# EAGLE design uart2dali_mr3020_2 (EAGLE 6.3)
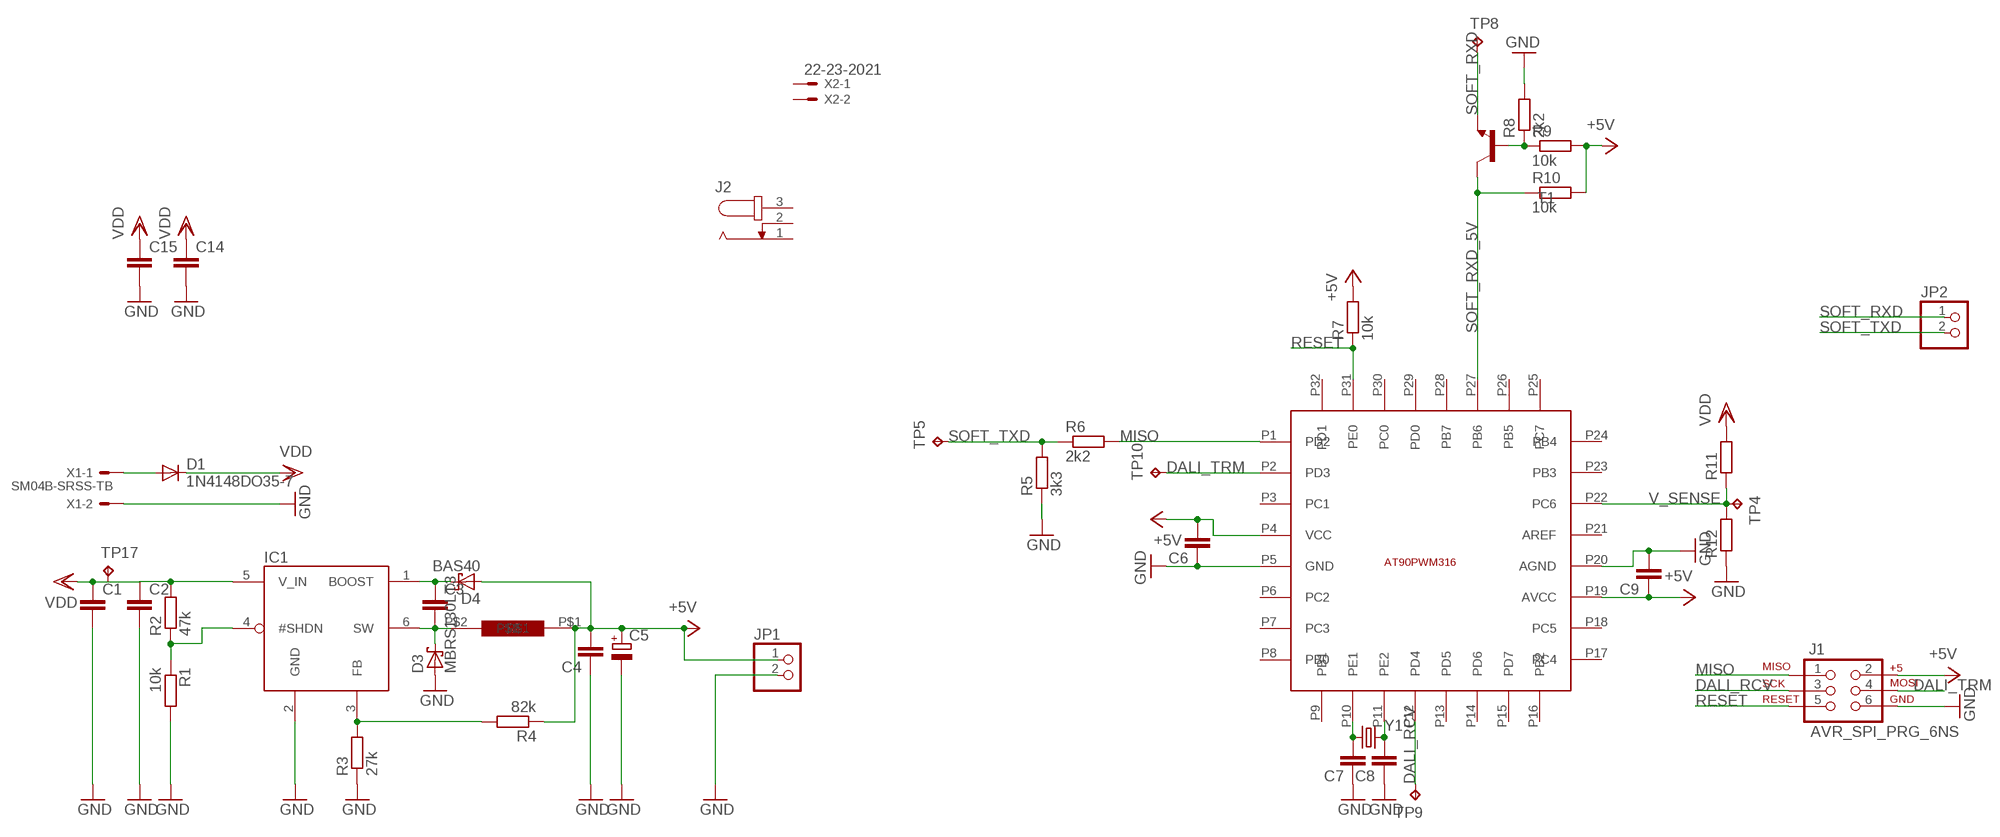
[diagram p0: schematic, sheet 1, part 1 of 2]
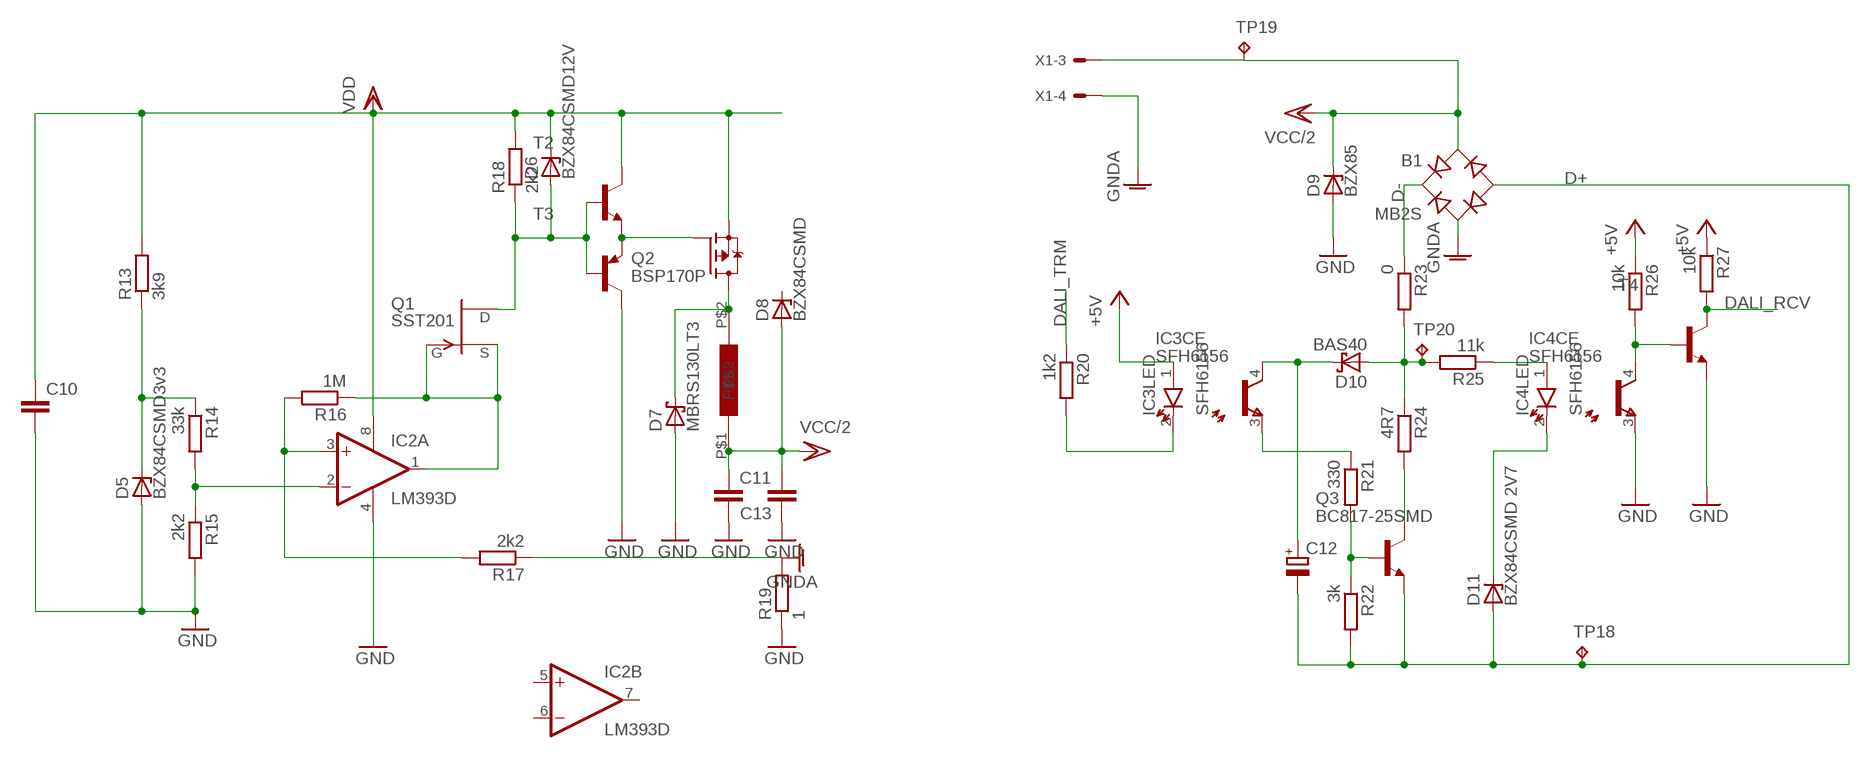
[diagram p1: schematic, sheet 1, part 2 of 2]

## Parts
B1  MB2S  [SOIC-4]
C1  C-EUC0805  [C0805]
C2  C-EUC0805  [C0805]
C3  C-EUC0805  [C0805]
C4  C-EUC0805  [C0805]
C5  CPOL-EUCT7343  [CT7343]
C6  C-EUC0603  [C0603]
C7  C-EUC0603  [C0603]
C8  C-EUC0603  [C0603]
C9  C-EUC0603  [C0603]
C10  C-EUC0603  [C0603]
C11  C-EUC0805  [C0805]
C12  CPOL-EUCT6032  [CT6032]
C13  C-EUC0805  [C0805]
C14  C-EUC0805  [C0805]
C15  C-EUC0805  [C0805]
D1  1N4148DO35-7  [DO35-7]
D3  MBRS130LT3  [SMB]
D4  BAS40  [SOT23]
D5  BZX84CSMD3v3  BZX84CSMD  [TO236]
D6  BZX84CSMD12V  BZX84CSMD  [TO236]
D7  MBRS130LT3  [SMB]
D8  BZX84CSMD  [TO236]
D9  BZX85  [DO41Z10]
D10  BAS40  [SOT23]
D11  BZX84CSMD 2V7  BZX84CSMD  [TO236]
IC1  LT1933ES6  [SOT23-6]
IC2  LM393D  [SO08]
IC3  SFH6156  [SFH]
IC4  SFH6156  [SFH]
J1  AVR_SPI_PRG_6NS  [2X3-NS]
J2  JACK-PLUG1  [SPC4078]
JP1  PINHD-1X2  [1X02]
JP2  PINHD-1X2  [1X02]
Q1  SST201  [SOT23]
Q2  BSP170P  [SOT223]
Q3  BC817-25SMD  [SOT23-BEC]
R1  10k  R-EU_R0603  [R0603]
R2  47k  R-EU_R0603  [R0603]
R3  27k  R-EU_R0603  [R0603]
R4  82k  R-EU_R0603  [R0603]
R5  3k3  R-EU_R0603  [R0603]
R6  2k2  R-EU_R0603  [R0603]
R7  10k  R-EU_R0603  [R0603]
R8  2k2  R-EU_R0603  [R0603]
R9  10k  R-EU_R0603  [R0603]
R10  10k  R-EU_R0603  [R0603]
R11  R-EU_R0603  [R0603]
R12  R-EU_R0603  [R0603]
R13  3k9  R-EU_R0603  [R0603]
R14  33k  R-EU_R0603  [R0603]
R15  2k2  R-EU_R0603  [R0603]
R16  1M  R-EU_R0603  [R0603]
R17  2k2  R-EU_R0603  [R0603]
R18  2k2  R-EU_R0603  [R0603]
R19  1  R-EU_R0603  [R0603]
R20  1k2  R-EU_R0603  [R0603]
R21  330  R-EU_R0603  [R0603]
R22  3k  R-EU_R0603  [R0603]
R23  0  R-EU_R0603  [R0603]
R24  4R7  R-EU_R0603  [R0603]
R25  11k  R-EU_R0603  [R0603]
R26  10k  R-EU_R0603  [R0603]
R27  10k  R-EU_R0603  [R0603]
T1  MMBT3904LT1-NPN-SOT23-BEC  [SOT23-BEC]
T2  MMBT3904LT1-NPN-SOT23-BEC  [SOT23-BEC]
T3  MMBT3640LT1-PNP-SOT23-BEC  [SOT23-BEC]
T4  MMBT3904LT1-NPN-SOT23-BEC  [SOT23-BEC]
TP4  TPB1,27  [B1,27]
TP5  TPB1,27  [B1,27]
TP8  TPB1,27  [B1,27]
TP9  TPB1,27  [B1,27]
TP10  TPB1,27  [B1,27]
TP17  TPB1,27  [B1,27]
TP18  TPB1,27  [B1,27]
TP19  TPB1,27  [B1,27]
TP20  TPB1,27  [B1,27]
U$1  KMP_2330_UNSHIELDED  [KMP_2330_UNSHIELDED]
U$2  AT90PWM316  [QFN32_7MM]
U$3  SDR0805  [SDR0805]
X1  SM04B-SRSS-TB  [SM04B-SRSS-TB]
X2  22-23-2021  [22-23-2021]
Y1  CRYSTALTXC-7A  [CRYSTAL-TXC-7A]

## Nets
+5V: C4.2 C5.+ C6.2 C9.1 D4.1(A) IC3.1(LED:A) J1.2 JP1.1 R4.1 R7.2 R9.2 R10.2 R26.1 R27.1 U$1.P$1 U$2.P4(VCC) U$2.P19(AVCC)
D+: B1.- C12.- D11.A Q3.E R22.2 TP18.TP
D-: B1.+ R23.1
DALI_RCV: IC4.4(CE:C) J1.3 R26.2 R27.2 T4.B T4.C TP9.TP U$2.P12(PD4)
DALI_TRM: J1.4 R20.1 TP10.TP U$2.P2(PD3)
GND: C1.2 C2.2 C4.1 C5.- C6.1 C7.1 C8.1 C9.2 C10.2 C11.2 C13.1 C14.2 C15.2 D3.A D5.A D7.A D9.A IC1.2(GND) IC2.4(P:V-) IC4.3(CE:E) J1.6 JP1.2 R1.2 R3.1 R5.1 R8.2 R12.1 R15.2 R19.1 T3.C T4.E U$2.P5(GND) U$2.P20(AGND) X1.2
GNDA: B1.~2(AC2) R17.1 R19.2 X1.4
MISO: J1.1 R6.2 U$2.P1(PD2)
N$1: IC3.2(LED:K) R20.2
N$2: IC2.2(A:-IN) R14.2 R15.1
N$3: IC1.4(#SHDN) R1.1 R2.1
N$4: C12.+ D10.3(C) IC3.4(CE:C)
N$5: IC3.3(CE:E) R21.1
N$6: Q3.B R21.2 R22.1
N$9: D10.1(A) R23.2 R24.1 R25.2 TP20.TP
N$10: Q3.C R24.2
N$11: IC4.1(LED:A) R25.1
N$12: D11.C IC4.2(LED:K)
N$16: C7.2 U$2.P10(PE1) Y1.P$1
N$19: C8.2 U$2.P11(PE2) Y1.P$2
N$20: R8.1 R9.1 T1.B
N$22: IC2.1(A:OUT) Q1.2(S) Q1.3(G) R16.1
N$23: D1.A X1.1
N$24: C3.1 D4.3(C) IC1.1(BOOST)
N$25: C3.2 D3.C IC1.6(SW) U$1.P$2
N$26: D7.C Q2.2(D) Q2.4(D) U$3.P$2
N$31: IC1.3(FB) R3.2 R4.2
N$33: Q2.1(G) T2.E T3.E
N$34: D6.A Q1.1(D) R18.1 T2.B T3.B
N$35: D5.C R13.1 R14.1
N$40: IC2.3(A:+IN) R16.2 R17.2
RESET: J1.5 R7.1 U$2.P31(PE0)
SOFT_RXD: JP2.1 T1.E TP8.TP
SOFT_RXD_5V: R10.1 T1.C U$2.P27(PB6)
SOFT_TXD: JP2.2 R5.2 R6.1 TP5.TP
V_SENSE: R11.1 R12.2 TP4.TP U$2.P22(PC6)
VCC/2: B1.~1(AC1) C11.1 C13.2 D8.A D9.C TP19.TP U$3.P$1 X1.3
VDD: C1.1 C2.1 C10.1 C14.1 C15.1 D1.C D6.C IC1.5(V_IN) IC2.8(P:V+) Q2.3(S) R2.2 R11.2 R13.2 R18.2 T2.C TP17.TP
Unconnected: D8.C IC2.5(B:+IN) IC2.6(B:-IN) IC2.7(B:OUT) J2.1 J2.2 J2.3 U$2.P3(PC1) U$2.P6(PC2) U$2.P7(PC3) U$2.P8(PB0) U$2.P9(PB1) U$2.P13(PD5) U$2.P14(PD6) U$2.P15(PD7) U$2.P16(PB2) U$2.P17(PC4) U$2.P18(PC5) U$2.P21(AREF) U$2.P23(PB3) U$2.P24(PB4) U$2.P25(PC7) U$2.P26(PB5) U$2.P28(PB7) U$2.P29(PD0) U$2.P30(PC0) U$2.P32(PD1) X2.1 X2.2

## Library data of the parts
B1 = rectifier:MB*S: Bridge Rectifier Source: http://www.fairchildsemi.com/ds/MB/MB6S.pdf
C1-C4 C6-C11 C13-C15 = resistor:C-EU: CAPACITOR, European symbol
C5 C12 = resistor:CPOL-EU: POLARIZED CAPACITOR, European symbol
D1 = diode:1N4148: DIODE high speed (Philips)
D3 D7 = diode:MBRS130LT3: Schottky Power Rectifier Source: http://www.onsemi.com/pub/Collateral/MBRS130LT3-D.PDF
D4 D10 = diode:BAS40: Silicon Schottky Diodes General-purpose diode for high-speed switching
D5 D6 D8 D11 = diode:BZX84CSMD: Z DIODE
D9 = diode:BZX85: Z DIODE
IC1 = ltc_swr:LT1933: LT1933 - 600mA, 500kHz Step-Down Switching Regulator in SOT-23 Wide Input Range: 3.6V to 36V 5V at 600mA from 16V to 36V Input 3.3V at 600mA from 12V to 36V Input 5V at 500mA from 6.3V to 36V Input 3.3V at 500mA from 4.5V to 36V Input Fixed Frequency 500kHz Operation Uses Tiny Capacitors and Inductors Soft-Start Internally Compensated Low Shutdown Current: <2µA Output Adjustable Down to 1.25V Low Profile (1mm) SOT-23 (ThinSOT™) and (2mm x 3mm x 0.75mm) 6-Pin DFN Packages
IC2 = linear:LM393: COMPARATOR
IC3 IC4 = optocoupler:SFH6156: 5.3 kV TRIOS High Reliability Optocoupler; MF: VISHAY/TELEFUNKEN; MPN: SFH6156-4T; OC_FARNELL: 1612479; OC_NEWARK: 21H7733
J1 = SparkFun-Connectors:AVR_SPI_PRG_6: AVR ISP 6 Pin This is the reduced ISP connector for AVR programming. Common on Arduino. This footprint will take up less PCB space and can be used with a 10-pin to 6-pin adapter such as SKU: BOB-08508
J2 = con-jack:JACK-PLUG: DC POWER JACK Power Jack, DC, Right Angle, Through Hole, Rated 5A at 16VDC, PC Terminals Distributor: Farnell (www.Farnell.de) Drawing: 84N1161.pdf / 84N1162.pdf Manufacturer: SPC Technology (www.spctechnology.com) Type: SPC4077 / SPC 4078; OC_FARNELL: unknown; OC_NEWARK: unknown
JP1 JP2 = pinhead:PINHD-1X2: PIN HEADER
Q1 = transistor-fet:?20*: TEMIC / Siliconix N-Channel JFET Source: JFET-J201_Siliconix_data.pdf
Q2 = transistor-fet:BSP170P: SIPMOS(R) Small-Signal-Transistor P-Channel, Enhancement mode Source: http://www.infineon.com/upload/Document/BSP170P_Rev2.4.pdf
Q3 = transistor-npn:BC817*: NPN Transistor
R1-R27 = resistor:R-EU_: RESISTOR, European symbol
T1 T2 T4 = transistor:*-NPN-: NPN Transistror BF959 corrected 2008.03.06
T3 = transistor:*-PNP-: PNP Transistror
TP4 TP5 TP8-TP10 TP17-TP20 = testpad:TP: Test pad
U$1 = inductor:KMP_2330_UNSHIELDED
U$2 = at90pwm316:AT90PWM316
U$3 = inductor:SDR0805
X1 = con-jst2:?M04B-SRSS-TB: Disconnectable Crimp style connector, 1.0mm pitch 4 contacts
X2 = con-molex:22-23-2021: .100" (2.54mm) Center Header - 2 Pin; MF: MOLEX; MPN: 22-23-2021; OC_FARNELL: 1462926; OC_NEWARK: 25C3832
Y1 = SparkFun-FreqCtrl:CRYSTAL: Various standard crystals. Proven footprints. Spark Fun Electronics SKU : COM-00534

## Board
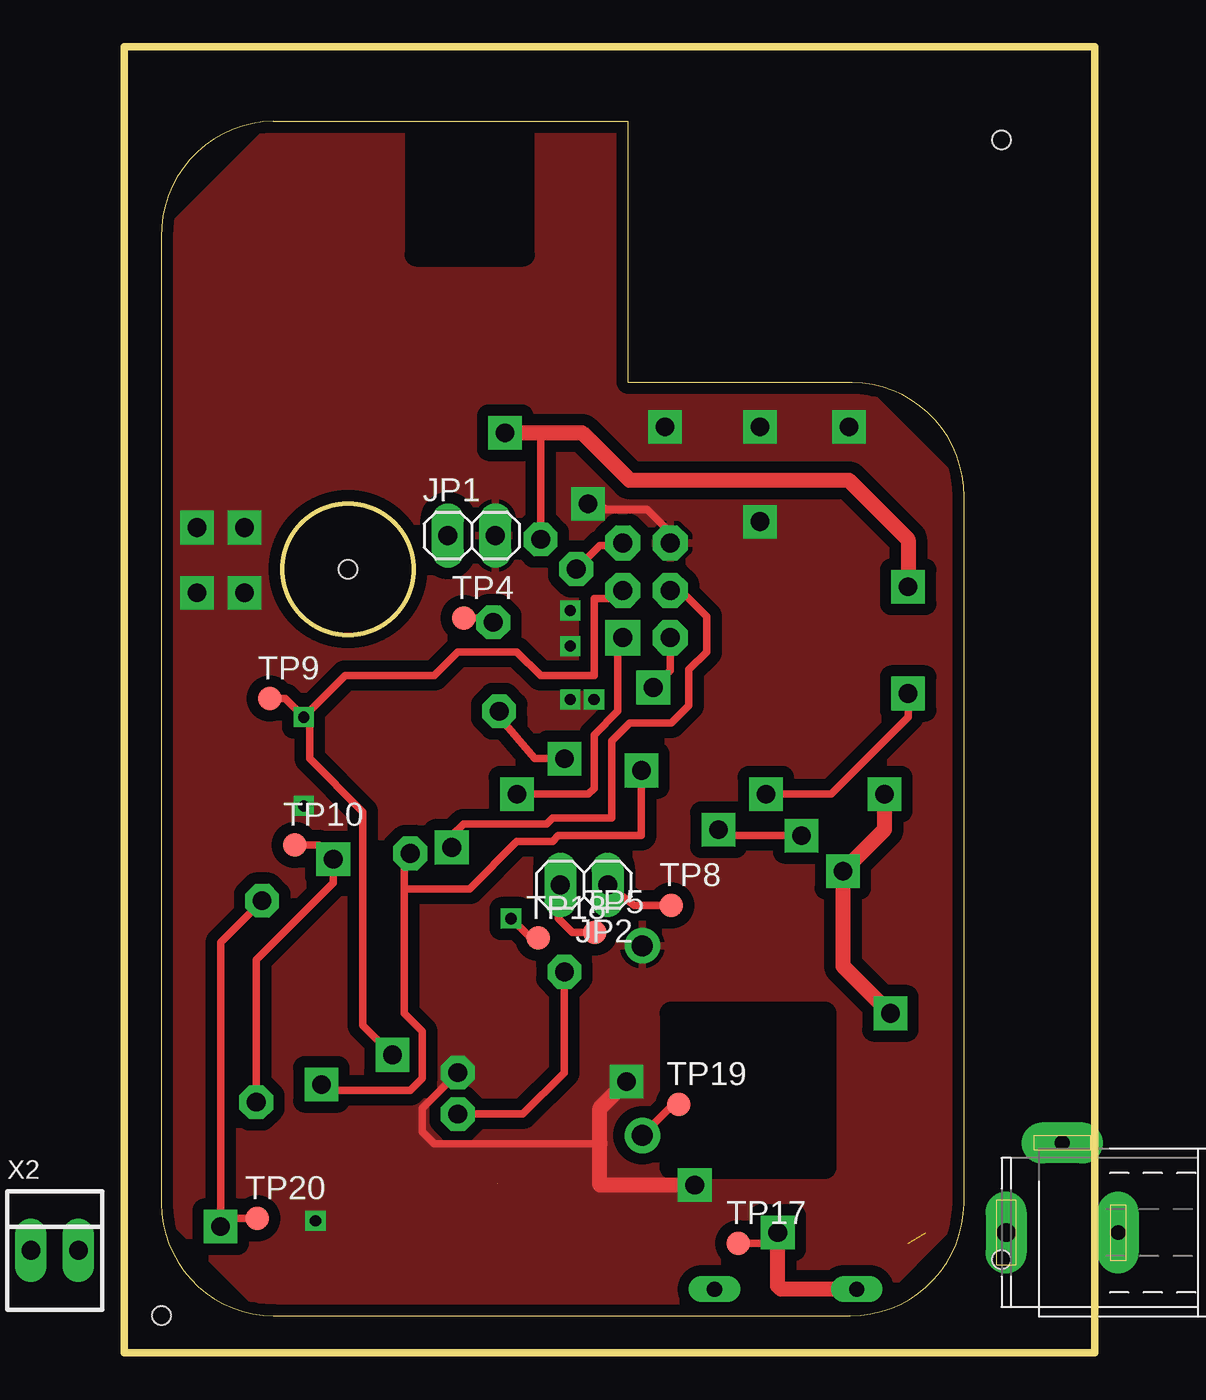
[diagram p2: board, top side]
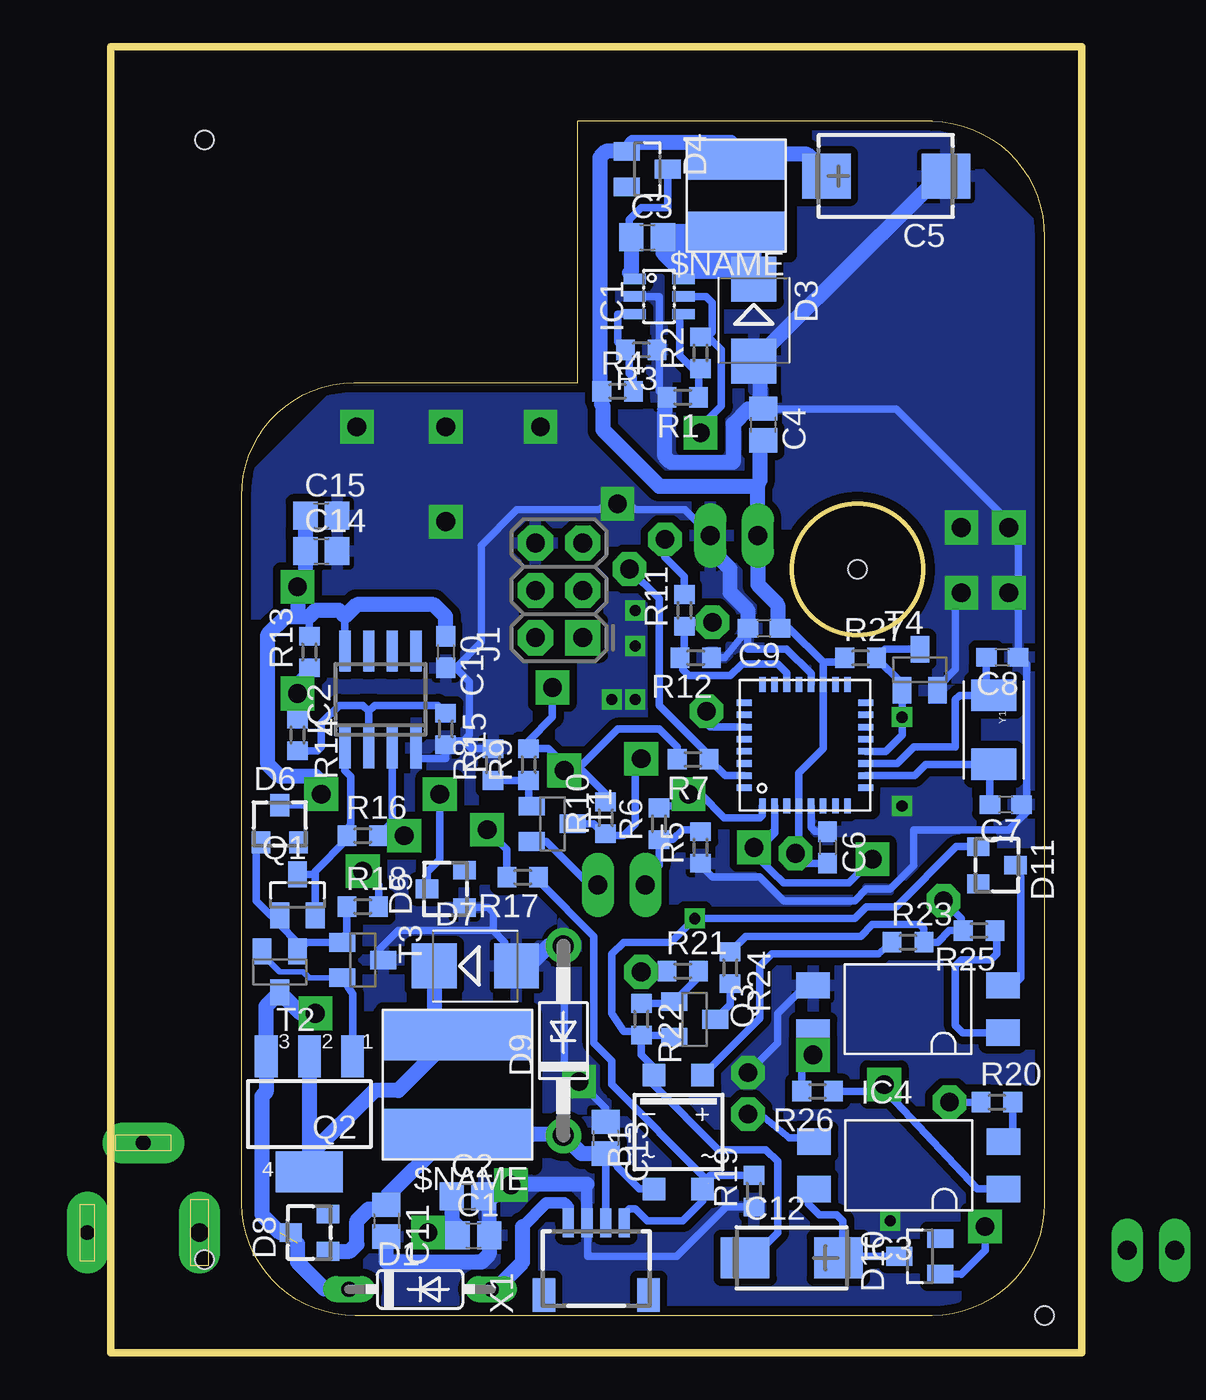
[diagram p3: board, bottom side, seen from below]

Size 52 x 70 mm. Coordinates in mm from the lower left corner, seen from the top.
Outline: 8,66 arc90 2,59.8 2,8 arc90 8,2 38.9,2 arc90 45,8 45,45.9 arc90 39,52 27,52 27,66 8,66
Outline: 0,0 52,0 52,70 0,70 0,0
Outline: circle at 12,42 radius 3.5
Copper layers (1*16): Top 0.035mm / dielectric 1.5mm / Bottom 0.035mm
Design rules "default *": minimum track width 10mil, minimum drill 24mil, track to track 12mil, track to pad 12mil, pad to pad 10mil, via to via 8mil, smd to smd 0mil, copper to edge 20mil, drill to drill 8mil, minimum pad ring 10mil, minimum via ring 8mil, stop-mask expansion 4mil, vias tented up to drill 0mil, thermal gap 10mil
Holes 1 mm at 47,65 47,5 12,42 2,2
bKeepout: area 2,46 to 15,60
tRestrict: area 29.3,9.9 to 37.6,18.2; area 15.7,58.8 to 21.4,65.8
bRestrict: area 11.2,29 to 18.5,36.3; area 29.3,9.9 to 37.6,18.2; area 15.7,58.8 to 21.4,65.8; area 5.8,33.1 to 8,34.4

### Footprints (pad centres in the part's own frame; a part is rotated, then mirrored left to right if it is on the bottom)
SOIC-4 = smd 1.2 x 1.2: + 1.3,3.05; - -1.3,3.05; ~1 -1.3,-3.05; ~2 1.3,-3.05
C0805 = smd 1.3 x 1.5: 1 -0.85,0; 2 0.85,0
CT7343 = smd 2.6 x 2.4: + 3.2,0; - -3.2,0
C0603 = smd 1.1 x 1: 1 -0.85,0; 2 0.85,0
CT6032 = smd 2.6 x 2.2: + 2.5,0; - -2.5,0
DO35-7 = drill 0.813 long: A 3.81,0; C -3.81,0
SMB = smd 2.4 x 2.4: A 2.2,0; C -2.2,0
SOT23 = smd 1 x 1.4: 1 -0.95,-1.1; 2 0.95,-1.1; 3 0,1.1
TO236 = smd 1 x 1.2: A -1,-1; C 0,1; NC 1,-1
DO41Z10 = drill 1.118: A 5.08,0; C -5.08,0
SOT23-6 = smd 0.55 x 1.2: 1 -0.95,-1.3; 2 0,-1.3; 3 0.95,-1.3; 4 0.95,1.3; 5 0,1.3; 6 -0.95,1.3
SO08 = smd 0.6 x 2.2: 1 -1.905,-2.6; 2 -0.635,-2.6; 3 0.635,-2.6; 4 1.905,-2.6; 5 1.905,2.6; 6 0.635,2.6; 7 -0.635,2.6; 8 -1.905,2.6
SFH = smd 1.4 x 1.8: 1 1.27,5.08; 2 -1.27,5.08; 3 -1.27,-5.08; 4 1.27,-5.08
2X3-NS = drill 1.016 pad 1.88 square: 1 -2.54,-1.27 | drill 1.016 pad 1.88 octagon: 2 -2.54,1.27; 3 0,-1.27; 4 0,1.27; 5 2.54,-1.27; 6 2.54,1.27
SPC4078 = drill 0.8 pad 2.184 long: 1 -3,0; 2 0,-4.8 | drill 1 pad 2.184 long: 3 3,0
1X02 = drill 1.016 long: 1 -1.27,0; 2 1.27,0
SOT223 = smd 1.219 x 2.235: 1 -2.311,-3.099; 2 0,-3.099; 3 2.311,-3.099 | smd 3.6 x 2.2: 4 0,3.099
SOT23-BEC = smd 1 x 1.4: B -0.95,-1.1; C 0,1.1; E 0.95,-1.1
R0603 = smd 1 x 1.1: 1 -0.85,0; 2 0.85,0
B1,27 = smd 1.27 x 1.27: TP 0,0
KMP_2330_UNSHIELDED = smd 5.3 x 2.15: P$1 0,-1.925; P$2 0,1.925
QFN32_7MM = smd 0.813 x 0.35: P1 -3.25,2.275; P2 -3.25,1.625; P3 -3.25,0.975; P4 -3.25,0.325; P5 -3.25,-0.325; P6 -3.25,-0.975; P7 -3.25,-1.625; P8 -3.25,-2.275; P17 3.25,-2.275; P18 3.25,-1.625; P19 3.25,-0.975; P20 3.25,-0.325; P21 3.25,0.325; P22 3.25,0.975; P23 3.25,1.625; P24 3.25,2.275 | smd 0.35 x 0.813: P9 -2.275,-3.25; P10 -1.625,-3.25; P11 -0.975,-3.25; P12 -0.325,-3.25; P13 0.325,-3.25; P14 0.975,-3.25; P15 1.625,-3.25; P16 2.275,-3.25; P25 2.275,3.25; P26 1.625,3.25; P27 0.975,3.25; P28 0.325,3.25; P29 -0.325,3.25; P30 -0.975,3.25; P31 -1.625,3.25; P32 -2.275,3.25
SDR0805 = smd 8 x 2.7: P$1 0,2.65; P$2 0,-2.65
SM04B-SRSS-TB = smd 0.6 x 1.55: 1 -1.5,2.975; 2 -0.5,2.975; 3 0.5,2.975; 4 1.5,2.975 | smd 1.2 x 1.8: FIT@1 -2.8,-0.9; FIT@2 2.8,-0.9
22-23-2021 = drill 1 long: 1 -1.27,0; 2 1.27,0
CRYSTAL-TXC-7A = smd 1.7 x 2.4: P$1 1.85,0; P$2 -1.85,0

### Placement (x,y rotation side)
B1  21.6,11.83 0 bottom
C1  32.59,6.29 0 bottom
C2  32.89,8.38 0 bottom
C3  23.27,59.78 0 bottom
C4  17.06,49.75 270 bottom
C5  10.48,63.06 180 bottom
C6  13.61,27.09 270 bottom
C7  4.07,29.38 180 bottom
C8  4.25,37.28 180 bottom
C9  17.02,38.83 180 bottom
C10  34.07,37.56 270 bottom
C11  37.24,7.08 270 bottom
C12  15.53,5.09 0 bottom
C13  25.5,11.53 270 bottom
C14  40.73,42.96 0 bottom
C15  40.73,44.86 0 bottom
D1  35.44,3.41 0 bottom
D3  17.56,55.34 270 bottom
D4  23.27,63.44 270 bottom
D5  34.07,24.86 90 bottom
D6  42.96,28.35 0 bottom
D7  32.48,20.73 0 bottom
D8  41.37,6.45 90 bottom
D9  27.77,16.73 90 bottom
D10  8.67,5.17 90 bottom
D11  4.54,26.13 270 bottom
IC1  22.64,56.61 270 bottom
IC2  37.56,35.02 0 bottom
IC3  9.25,10.05 270 bottom
IC4  9.3,18.43 270 bottom
J1  27.99,40.86 90 bottom
J2  50.26,6.45 180 top
JP1  18.62,43.8 0 top
JP2  24.64,25.08 180 top
Q1  42.01,24.54 0 bottom
Q2  41.37,12.79 180 bottom
Q3  20.73,17.88 270 bottom
R1  21.37,51.21 180 bottom
R2  20.41,53.59 90 bottom
R3  23.59,53.75 180 bottom
R4  24.86,51.53 0 bottom
R5  20.41,27.08 90 bottom
R6  22.64,28.35 90 bottom
R7  20.81,31.8 180 bottom
R8  31.53,31.53 90 bottom
R9  29.62,31.53 90 bottom
R10  25.5,28.67 90 bottom
R11  21.28,39.78 90 bottom
R12  20.67,37.25 180 bottom
R13  41.37,37.56 90 bottom
R14  42.01,33.11 270 bottom
R15  34.07,33.43 270 bottom
R16  38.51,27.72 0 bottom
R17  29.94,25.5 180 bottom
R18  38.51,23.91 0 bottom
R19  17.56,8.67 90 bottom
R20  4.54,13.43 0 bottom
R21  21.37,20.46 0 bottom
R22  23.59,17.88 270 bottom
R23  9.3,22 0 bottom
R24  18.83,20.64 270 bottom
R25  5.49,22.64 180 bottom
R26  14.14,14.02 180 bottom
R27  11.84,37.24 0 bottom
T1  28.35,28.35 270 bottom
T2  42.96,20.41 180 bottom
T3  38.51,21.05 270 bottom
T4  8.67,36.61 0 bottom
TP4  18.2,39.37 0 top
TP5  25.21,22.54 0 top
TP8  29.32,23.98 0 top
TP9  7.81,35.06 0 top
TP10  9.16,27.22 0 top
TP17  32.91,5.88 0 top
TP18  22.18,22.23 0 top
TP19  29.7,13.32 0 top
TP20  7.13,7.21 0 top
U$1  18.51,62.01 180 bottom
U$2  14.82,32.56 90 bottom
U$3  33.43,14.38 180 bottom
X1  26,4 0 bottom
X2  -3.71,5.49 0 top
Y1  4.71,33.39 270 bottom

### Tracks (layer width: path | path; a pad name or v marks a point on that pad's centre or on a via)
+5V  (via drill 1)
  Top 0.406: v27.72,31.21 27.72,27.72 23.27,27.72 22.95,27.4 21.05,27.4 18.51,24.86 15.02,24.86 | 15.02,24.86 15.02,18.19 15.97,17.24 15.97,14.7 15.34,14.06 10.57,14.06 v10.57,14.38 | v15.34,26.77 15.02,26.45 15.02,24.86 | J1.2 29.26,36.56 v28.35,35.66
  Bottom 0.406: IC3.1 5.61,8.78 9.94,13.43 10.26,13.75 v10.57,14.38 10.62,14.02 R26.1 | 27.72,31.53 28.57,32.38 R9.2 29.62,32.8 28.35,34.07 v28.35,35.66 | 27.72,31.53 v27.72,31.21 26.77,31.21 25.5,29.94 R10.2 | C9.1 15.65,38.83 13.85,37.02 | 13.85,37.02 U$2.P19 13.85,32.38 15.15,31.08 U$2.P4 15.15,26.89 v15.34,26.77 14.8,26.23 C6.2 | R7.2 21.66,32.46 22.64,33.43 24.86,33.43 26.77,31.53 27.72,31.53 | 13.85,37.02 12.91,37.02 R27.1
  Bottom 0.813: 17.87,63.99 18.8,64.85 24.06,64.85 D4.1 25.49,64.39 25.81,64.07 25.81,51.63 R4.1 25.71,50.84 25.65,50.74 25.65,49.47 22.64,46.45 17.38,46.45 | 17.87,63.99 U$1.P$1 | C5.+ 14.13,63.66 14.7,64.23 17.63,64.23 17.87,63.99 | C4.2 17.24,48.9 17.24,46.77 17.38,46.45 | 17.38,46.45 17.38,45.1 JP1.1 17.35,41.16 16.29,40.1 16.29,38.95 C9.1
D+  (via drill 0.6)
  Top 0.406: TP18.TP 22.1,21.91 v20.73,23.27
  Bottom 0.406: C12.- 17.64,5.09 16.29,6.45 16.29,10.26 16.92,10.89 19.46,10.89 22.95,14.38 22.95,14.82 B1.- 22.9,15.28 23.59,15.97 R22.2 | R22.2 21.93,17.02 Q3.E | D11.A 6.71,27.13 9.94,23.91 11.53,23.91 12.16,23.27 v20.73,23.27 22,22 24.54,22 25.18,21.37 25.18,18.19 24.54,17.24 23.8,17.24 R22.2
D-
  Bottom 0.406: R23.1 10.89,21.37 16.61,21.37 17.24,20.73 17.24,17.94 B1.+
DALI_RCV  (via drill 0.6, 1)
  Top 0.406: v14.38,15.97 12.79,17.56 12.79,28.99 9.94,31.84 9.94,33.75 v9.62,34.07 | J1.3 26.27,40.42 25.18,40.42 25.18,36.29 22.32,36.29 21.05,37.56 17.88,37.56 16.61,36.29 11.84,36.29 v9.62,34.07 | 7.81,35.11 TP9.TP 8.62,35.06 v9.62,34.07
  Bottom 0.406: R26.2 15.02,14.06 14.99,14.36 14.99,15.97 | 14.99,15.97 14.99,16.86 IC4.4 | v14.38,15.97 14.99,15.97 | U$2.P12 10.5,32.23 9.62,33.11 v9.62,34.07 T4.B 9.62,35.87 R27.2 10.53,37.71 T4.C
DALI_TRM  (via drill 1)
  Top 0.406: v7.08,13.43 7.08,21.05 11.21,25.18 v11.21,26.45 10.44,27.22 TP10.TP | J1.4 29.81,40.86 31.21,39.47 31.21,37.56 30.26,36.61 30.26,34.7 29.3,33.75 27.08,33.75 26.13,32.8 26.13,28.67 22.95,28.67 22.64,28.35 18.19,28.35 17.56,27.72 v17.56,27.08
  Bottom 0.406: U$2.P2 16.45,28.04 | 16.45,28.04 16.45,27.88 17.24,27.08 17.24,26.45 16.77,25.97 16.61,25.81 15.97,25.18 12.48,25.18 v11.21,26.45 | v7.08,13.43 R20.1 | v17.56,27.08 16.45,28.04
GND  (via drill 0.6, 1)
  Top 0.406: v17.88,15.02 15.97,13.11 15.97,11.84 16.61,11.21 25.5,11.21 | J1.6 29.26,43.96 28.04,45.18 25.81,45.18 25.5,45.5 v24.86,45.5
  Top 0.813: v30.57,8.98 25.5,8.98 25.5,11.21 25.5,13.11 v26.92,14.54
  Bottom 0.406: T3.C 37.73,21.52 36.61,22.64 31.53,22.64 | 31.53,22.64 30.89,22 30.89,20.71 D7.A | D5.A 31.8,23.86 31.53,23.59 31.53,22.64 | C10.2 33.53,36.71 | 33.53,36.71 32.8,35.97 32.8,33.11 33.11,32.8 | 33.11,32.8 33.85,32.8 R15.2 34.07,31.84 35.66,31.84 IC2.4 | C13.1 25.5,13.11 v26.92,14.54 27.72,15.34 27.72,21.45 D9.A | IC4.3 15.1,19.38 16.29,18.19 16.29,16.61 v17.88,15.02 | X1.2 26.45,6.92 26.45,5.17 21.68,5.17 19.04,7.82 R19.1 | IC1.2 22.64,56.61 22.64,53.85 R3.1 22.64,53.65 22.64,51.53 22.22,51.11 R1.2 | U$2.P20 14.5,36.41 15.81,37.72 17.88,37.72 17.88,38.2 C9.2 19.13,37.25 R12.1 | C4.1 17.36,50.58 17.24,50.58 9.94,50.58 3.41,44.05 C8.1 3.3,37.28 2.95,36.92 2.95,29.65 C7.1 2.95,29.12 2.95,28.99 3.91,28.04 8.98,28.04 8.98,26.13 10.26,24.86 11.53,24.86 12.16,24.23 15.97,24.23 17.24,25.5 19.78,25.5 20.41,26.13 R5.1 | JP1.2 21.27,45.18 23.91,45.18 24.23,45.5 v24.86,45.5 25.5,45.5 25.81,45.18 30.26,45.18 32.16,43.27 32.16,38.08 33.53,36.71 | U$2.P5 14.5,28.15 14.28,27.93 C6.1 | R8.2 32.7,32.38 33.11,32.8 | T4.E 7.72,35.65 6.76,36.61 6.76,40.42 v6.45,40.73
  Bottom 0.61: X1.2 26.5,9.04
  Bottom 0.813: 26.5,9.04 30.52,9.04 v30.57,8.98 31.53,8.35 31.69,8.35 C2.2 31.74,8.37 C1.2 31.74,5.28 32.16,4.86 37.24,4.86 C11.2 | D9.A 28.57,21.81 28.57,21.79 29.62,20.73 D7.A | D3.A 15.02,55.68 13.43,57.24 8.03,62.64 7.7,62.64 C5.- | D3.A 17.24,52.8 17.24,50.77 C4.1 | D3.A 17.24,52.48 17.24,50.58 17.88,50.58 18.67,49.78 18.67,47.72 22,47.72 22.32,48.04 22.32,50.48 R1.2 | C9.2 17.87,39.77 18.83,40.73 18.83,42.01 19.78,42.96 19.78,43.69 JP1.2
  other vias: 28.99,49.62 34.07,49.62 38.83,49.62 3.91,40.73 3.91,44.23 34.07,44.55 6.45,44.23 23.91,37.88 23.91,39.78 23.91,35.02 25.18,35.02 9.62,29.3 10.26,7.08
  pour Top (isolate 0.61): 2,59.78 8.03,65.82 27.08,65.82 27.08,52.16 39.47,52.16 39.47,51.85 45.18,46.13 45.18,7.71 39.47,2 7.71,2 2,7.71
  pour Bottom (isolate 0.406): 2,59.78 8.03,65.82 27.08,65.82 27.08,52.16 39.15,52.16 39.47,51.85 44.86,46.45 45.18,46.13 45.18,7.71 39.47,2 7.71,2 2,7.71
GNDA  (1 unrouted)
  Bottom 0.406: X1.4 24.54,7.02 24.54,7.4 24.23,7.71 23.91,7.71 23.27,7.08 21.37,7.08 20.3,8.15 B1.~2 19.99,9.09 | 20,9.09 20.1,8.98 20.1,9.3 | 20.1,9.3 25.18,14.38 25.18,15.65 26.13,16.61 26.13,22.32 28.99,25.18 28.99,25.39 R17.1 | R19.2 19.88,9.52 20.1,9.3
MISO  (via drill 1)
  Top 0.406: v21.05,29.94 24.86,29.94 25.18,30.26 25.18,33.11 26.45,34.38 26.45,38.05 J1.1
  Bottom 0.406: U$2.P1 17.1,28.81 17.24,28.67 19.15,28.68 20.41,29.94 v21.05,29.94 21.68,29.3 22.32,29.3 | 22.32,29.3 22.54,29.3 | 22.54,29.3 R6.2 | 22.54,29.3 22.54,29.41 22.32,29.3
N$1
  Bottom 0.406: R20.2 3.69,11.8 IC3.2
N$2
  Bottom 0.406: IC2.2 38.2,34.38 | 38.2,34.38 37.88,34.7 34.49,34.7 R15.1 | R14.2 40.95,32.27 40.73,32.48 40.73,33.75 39.78,34.7 38.51,34.7 38.2,34.38
N$3
  Bottom 0.406: R1.1 20.52,52.69 R2.1 20.84,52.74 21.53,53.44 21.53,55.63 IC1.4
N$4
  Bottom 0.406: IC3.4 14.65,7.99 14.06,7.4 13.11,7.4 12.79,7.08 12.79,5.33 C12.+ 12.95,5.17 D10.3
N$5  (via drill 1)
  Top 0.406: v23.59,20.41 23.59,15.02 21.37,12.79 v17.88,12.79
  Bottom 0.406: R21.1 22.27,20.46 v23.59,20.41 | v17.88,12.79 17.24,12.79 15.65,11.53 14.86,11.53 IC3.3
N$6
  Bottom 0.406: R21.2 20.52,20.14 Q3.B 21.93,18.73 R22.1
N$9  (via drill 1)
  Top 0.406: v7.4,24.23 5.17,22 v5.17,6.76 5.62,7.21 TP20.TP
  Bottom 0.406: D10.1 6.45,4.22 5.17,5.5 v5.17,6.76 | v7.4,24.23 6.45,23.27 6.45,22.74 R25.2 7.08,22.64 7.71,22 R23.2 8.45,22.74 8.67,22.95 11.21,22.95 11.84,22.32 17.99,22.32 R24.1
N$10
  Bottom 0.406: R24.2 18.83,18.68 Q3.C
N$11
  Bottom 0.406: IC4.1 6.36,17.16 6.76,17.56 6.76,20.73 6.45,21.05 4.86,21.05 4.54,21.37 4.54,22.54 R25.1
N$12
  Bottom 0.406: IC4.2 3.67,19.7 3.27,20.1 3.27,25.54 D11.C
N$16
  Bottom 0.406: U$2.P10 8.94,30.93 8.35,31.53 6.31,31.53 Y1.P$1 4.92,31.34 C7.2
N$19
  Bottom 0.406: U$2.P11 9.88,31.59 8.98,32.48 6.76,32.48 6.76,35.02 6.54,35.24 Y1.P$2 5.11,35.63 C8.2
N$20
  Bottom 0.406: R8.1 R9.1 29.62,29.47 T1.B
N$22
  Bottom 0.406: Q1.3 41.2,25.64 41.05,25.81 | 41.05,25.81 41.05,23.76 Q1.2 | 41.05,25.81 39.36,27.5 R16.1 39.47,27.82 39.15,28.35 39.15,30.89 39.47,31.21 IC2.1
N$23
  Bottom 0.61: 29.94,6.76 28.67,8.03 27.72,8.03 27.5,7.82 X1.1
  Bottom 0.813: D1.A 31.39,3.41 29.94,4.86 29.94,6.76
N$24
  Bottom 0.406: D4.3 22.17,61.37 23.59,61.37 24.23,60.74 24.23,60.32 C3.1 | 24.23,57.88 23.91,57.53 IC1.1
  Bottom 0.813: C3.1 24.12,57.98 24.23,57.88
N$25
  Bottom 0.406: 21.37,57.88 21.05,57.53 IC1.6
  Bottom 0.813: D3.C 17.56,59.47 18.51,60.42 U$1.P$2 22.44,60.08 C3.2 22.42,58.94 21.37,57.88
N$26
  Bottom 0.813: U$3.P$2 33.96,16.71 34.54,16.13 | 34.54,16.13 36.61,14.06 37.88,14.06 41.37,10.57 | Q2.2 41.37,10.57 | 41.37,10.57 Q2.4 | D7.C 34.68,16.58 34.54,16.13
N$31
  Bottom 0.406: IC1.3 24.86,55.66 24.86,55.02 24.86,54.17 R3.2 24.23,53.54 24.23,52.48 24.01,52.27 R4.2
N$33
  Bottom 0.305: 43.91,21.36 42.96,20.41 41.69,20.41 41.37,20.1 39.93,20.1
  Bottom 0.406: Q2.1 39.06,19.23 T3.E 39.93,20.1 | T2.E 43.91,21.36
N$34
  Bottom 0.406: R18.1 39.36,22.57 T3.B 41.52,22 T2.B 42.01,22 42.96,22.95 Q1.1 43.45,23.44 44.23,24.23 44.23,27.5 D6.A
N$35  (via drill 1)
  Top 0.406: v34.38,29.94 37.88,29.94 42.01,34.07 v42.01,35.34
  Bottom 0.406: R14.1 v42.01,35.34 42.01,36.08 R13.1 | D5.C 35.07,25.77 34.38,26.45 v34.38,29.94
N$40  (via drill 1)
  Top 0.406: v31.84,28.04 32.16,27.72 v36.29,27.72
  Bottom 0.406: IC2.3 36.92,28.45 36.98,28.4 | 36.98,28.4 R16.2 | R17.2 30.79,26.98 v31.84,28.04 | v36.29,27.72 36.98,28.4
RESET  (via drill 1)
  Top 0.406: v24.23,42.01 25.5,43.27 26.53,43.27 J1.5
  Bottom 0.406: v24.23,42.01 22.64,40.42 22.64,34.7 19.96,32.03 R7.1 19.09,30.93 U$2.P31
SOFT_RXD
  Top 0.406: TP8.TP 27.33,23.98 JP2.1
  Bottom 0.406: T1.E 28.67,27.4 26.45,25.18 26.01,25.18 JP2.1
SOFT_RXD_5V  (via drill 1)
  Top 0.406: v23.59,31.84 22,31.84 20.1,34.07 v20.1,34.38
  Bottom 0.406: R10.1 25.6,27.82 | 25.6,27.82 26.13,28.35 T1.C | 25.6,27.82 25.5,27.72 24.54,27.72 23.91,28.35 23.91,31.53 v23.59,31.84 | U$2.P27 19.88,33.53 20.1,33.75 v20.1,34.38
SOFT_TXD
  Top 0.406: TP5.TP 24.01,22.54 23.27,23.27 23.27,24.66 JP2.2
  Bottom 0.406: JP2.2 23.59,25.18 22.64,26.13 R6.1 21.9,27.5 21.37,28.04 20.52,28.04 R5.2 20.62,27.93
V_SENSE  (via drill 1)
  Top 0.406: TP4.TP 19.56,39.37 v19.78,39.15
  Bottom 0.406: 21.28,37.48 R12.2 | U$2.P22 15.8,36.44 16.29,36.92 18.19,36.92 18.83,36.29 21.05,36.29 21.37,36.61 21.37,37.41 R12.2 | R12.2 21.28,37.64 R11.1 21.07,39.15 v19.78,39.15
VCC/2
  Top 0.406: TP19.TP 29.43,13.32 D9.C
  Bottom 0.406: X1.3 C13.2 25.39,10.57 24.86,9.94 23.7,8.78 B1.~1
  Bottom 0.813: C13.2 26.79,10.68 D9.C 27.84,11.73 U$3.P$1 34.18,11.41 37.24,8.35 C11.1 37.46,7.71 38.2,7.71 38.83,7.08 38.83,5.81 39.2,5.45 D8.A
VDD  (via drill 1)  (1 unrouted)
  Top 0.406: v22.32,43.59 22.32,49.31 | TP17.TP 34.77,5.88 v35.02,6.45
  Top 0.813: D1.C 35.2,3.41 35.02,3.59 v35.02,6.45 | v41.05,18.19 38.51,20.73 v38.51,25.81 40.73,28.04 v40.73,29.94 | v42.01,41.05 42.01,43.59 38.83,46.77 27.08,46.77 24.54,49.31 22.32,49.31 v20.41,49.31
  Bottom 0.406: R18.2 37.66,25.07 v38.51,25.81 | D6.C 41.32,29.35 v40.73,29.94 | IC2.8 39.47,39.47 | 41.37,39.47 R13.2 | IC1.5 20.1,56.61 19.78,56.29 19.78,54.7 20.02,54.47 | 20.02,54.47 20.41,54.39 20.31,54.39 R2.2 | R11.2 21.28,41.6 22.32,42.64 v22.32,43.59 | 20.36,49.68 19.3,50.74 19.3,53.75 20.02,54.47
  Bottom 0.813: v35.02,6.45 33.59,6.45 C1.1 33.42,6.3 33.42,6.75 33.75,7.08 C2.1 | D1.C 40.55,3.41 42.01,4.86 42.01,5.86 | 42.96,6.45 43.91,7.4 43.91,13.75 43.68,13.98 Q2.3 43.68,18.59 T2.C 41.84,18.19 v41.05,18.19 | v40.73,29.94 40.73,30.57 41.05,30.89 42.96,30.89 43.59,31.53 43.59,38.51 42.64,39.47 42.01,39.47 | 42.01,39.47 41.37,39.47 41.05,39.78 39.78,39.78 39.47,39.47 38.83,40.1 34.7,40.1 34.07,39.47 C10.1 | 42.01,39.47 v42.01,41.05 41.59,41.47 C14.1 C15.1 | 20.36,49.68 v20.41,49.31
(copper drawn outside any net)
  shapes: Bottom area x2